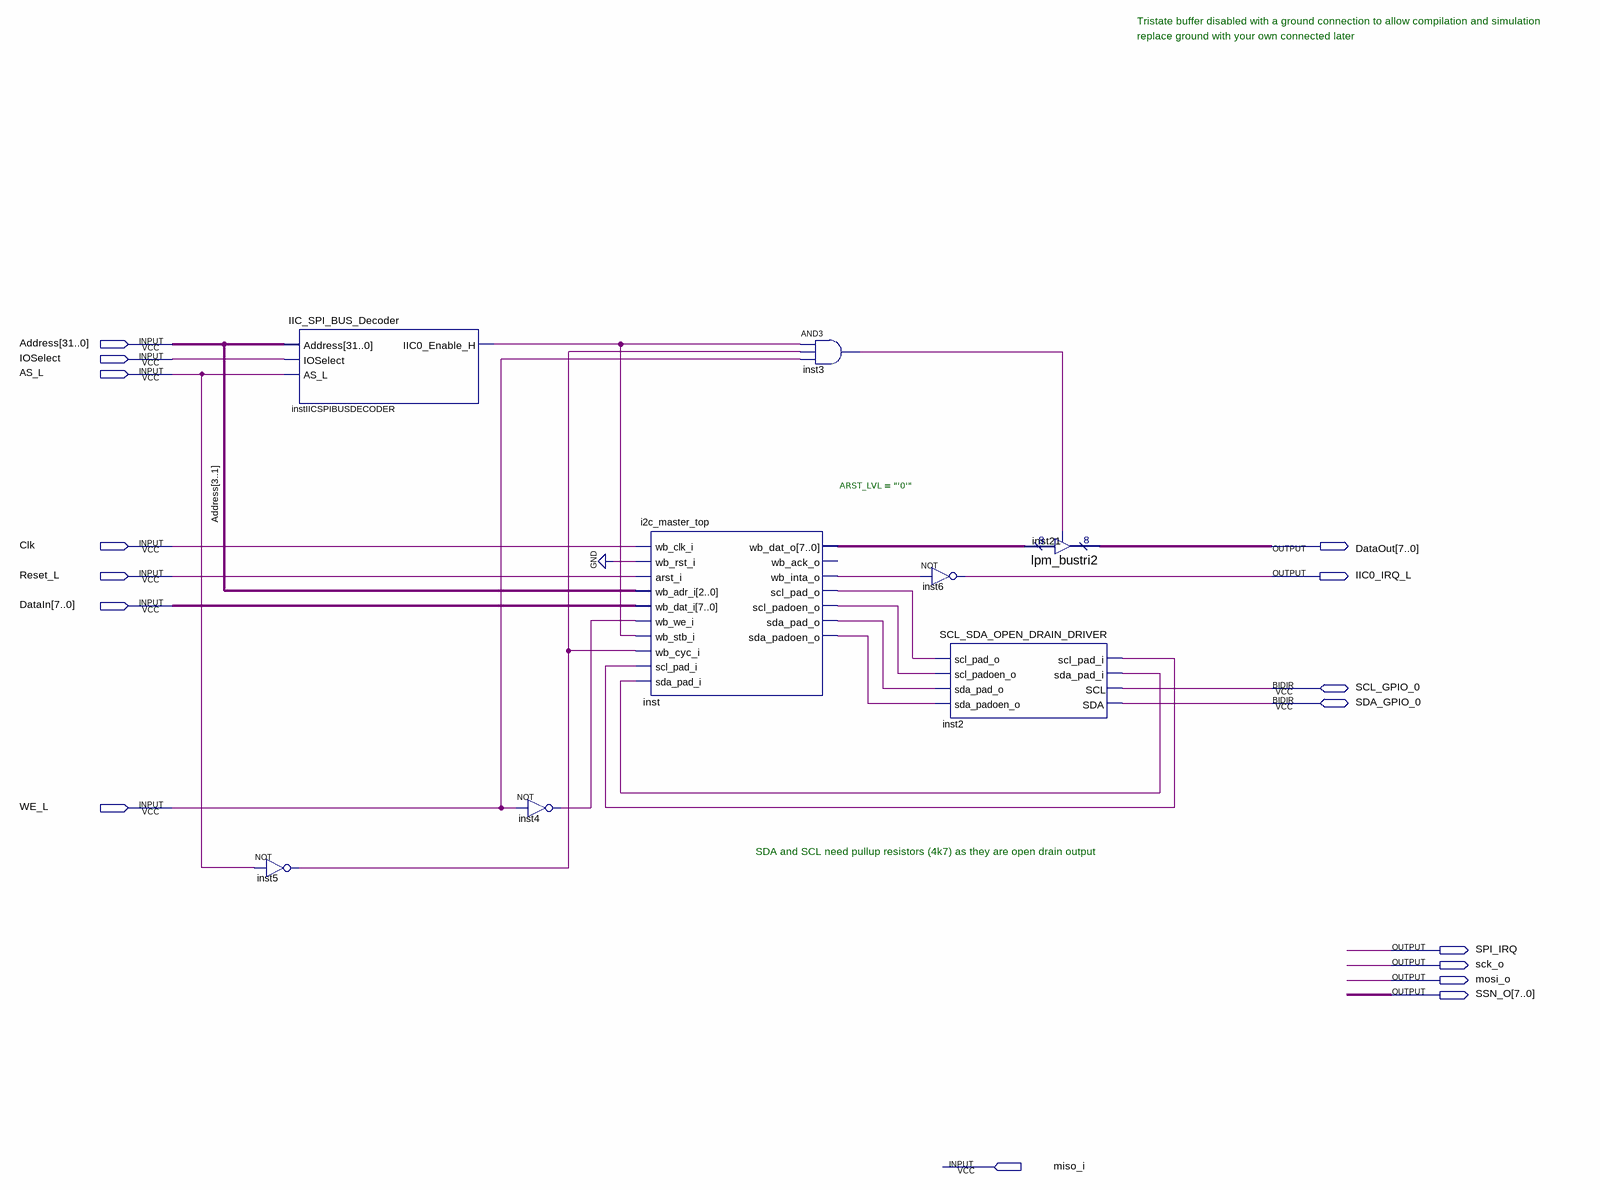
[diagram p0: schematic sheet]
// Quartus schematic IIC_SPI_Interface.bdf as structural Verilog: 8 symbols, 16 pins
module IIC_SPI_Interface (
  input  [31:0] Address,
  input  IOSelect,
  input  AS_L,
  input  Clk,
  input  Reset_L,
  input  [7:0] DataIn,
  input  WE_L,
  input  miso_i,
  inout  SCL_GPIO_0,
  inout  SDA_GPIO_0,
  output [7:0] DataOut,
  output IIC0_IRQ_L,
  output SPI_IRQ,
  output sck_o,
  output mosi_o,
  output [7:0] SSN_O
);

  wire inst2_scl_pad_i, inst2_sda_pad_i, inst3_out, inst4_out, inst5_out, inst_scl_pad_o, inst_scl_padoen_o,
       inst_sda_pad_o, inst_sda_padoen_o, inst_wb_inta_o, instIICSPIBUSDECODER_iic0_enable_h;
  wire [7:0] inst_wb_dat_o;

  IIC_SPI_BUS_Decoder instIICSPIBUSDECODER (
    .Address(Address), .IOSelect(IOSelect), .AS_L(AS_L), .IIC0_Enable_H(instIICSPIBUSDECODER_iic0_enable_h));
  not inst5 (inst5_out, AS_L);
  not inst4 (inst4_out, WE_L);
  i2c_master_top #(.ARST_LVL("'0'")) inst (
    .wb_clk_i(Clk), .wb_rst_i(1'b0), .arst_i(Reset_L), .wb_adr_i(Address[3:1]), .wb_dat_i(DataIn),
    .wb_we_i(inst4_out), .wb_stb_i(instIICSPIBUSDECODER_iic0_enable_h), .wb_cyc_i(inst5_out),
    .scl_pad_i(inst2_scl_pad_i), .sda_pad_i(inst2_sda_pad_i), .wb_dat_o(inst_wb_dat_o),
    .wb_inta_o(inst_wb_inta_o), .scl_pad_o(inst_scl_pad_o), .scl_padoen_o(inst_scl_padoen_o),
    .sda_pad_o(inst_sda_pad_o), .sda_padoen_o(inst_sda_padoen_o));  // open: wb_ack_o
  and inst3 (inst3_out, instIICSPIBUSDECODER_iic0_enable_h, inst5_out, WE_L);
  not inst6 (IIC0_IRQ_L, inst_wb_inta_o);
  SCL_SDA_OPEN_DRAIN_DRIVER inst2 (
    .scl_pad_o(inst_scl_pad_o), .scl_padoen_o(inst_scl_padoen_o), .sda_pad_o(inst_sda_pad_o),
    .sda_padoen_o(inst_sda_padoen_o), .scl_pad_i(inst2_scl_pad_i), .sda_pad_i(inst2_sda_pad_i),
    .SCL(SCL_GPIO_0), .SDA(SDA_GPIO_0));
  lpm_bustri2 inst21 (.enabledt(inst3_out), .data(inst_wb_dat_o), .tridata(DataOut));

  // Notes on the sheet:
  //   Tristate buffer disabled with a ground connection to allow compilation and simulation
  //   replace ground with your own connected later
  //   SDA and SCL need pullup resistors (4k7) as they are open drain output
endmodule
